# Altium schematic sheet MicroSD.SchDoc
size A4; SheetNumber: 1; SheetTotal: 3
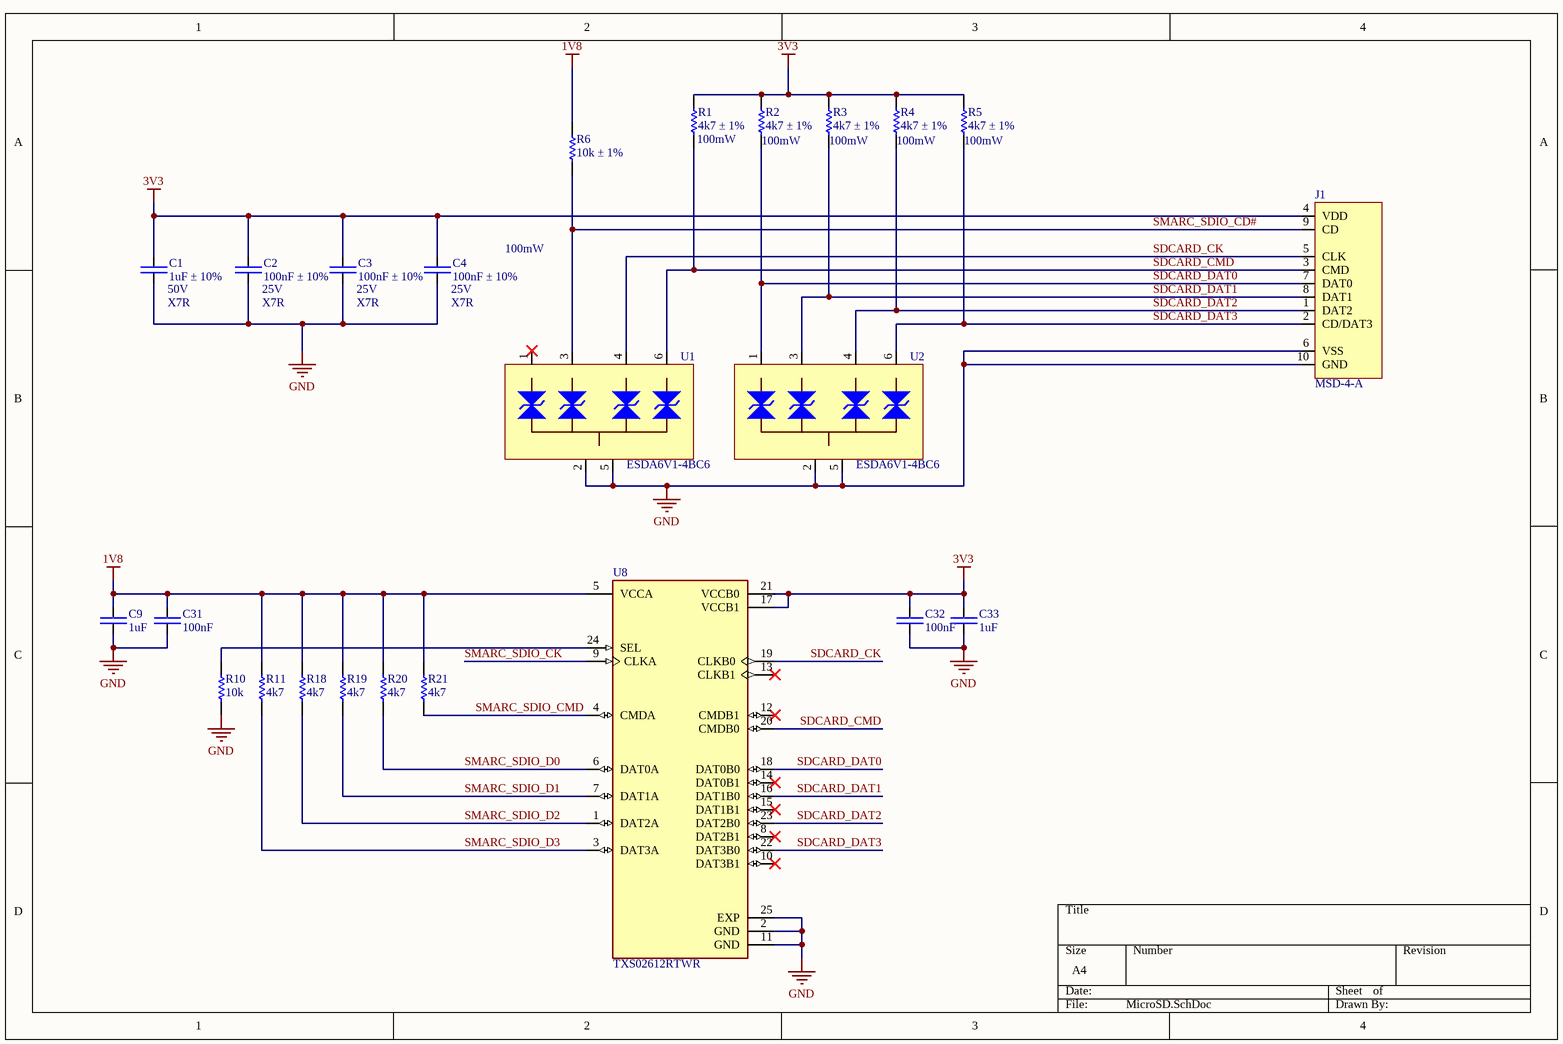
[diagram p0: MicroSD.SchDoc]

## Parts
C1  1uF ± 10%  [CAP-0805]
C2  100nF ± 10%  [CAP-0603]
C3  100nF ± 10%  [CAP-0603]
C4  100nF ± 10%  [CAP-0603]
C9  1uF  [CAP-0805]
C31  100nF  [CAP-0603]
C32  100nF  [CAP-0603]
C33  1uF  [CAP-0805]
J1  MSD-4-A  [MSD-4-A]
R1  4k7 ± 1%  [RES-0603]
R2  4k7 ± 1%  [RES-0603]
R3  4k7 ± 1%  [RES-0603]
R4  4k7 ± 1%  [RES-0603]
R5  4k7 ± 1%  [RES-0603]
R6  10k ± 1%  [RES-0603]
R10  10k  [RES-0603]
R11  4k7  [RES-0603]
R18  4k7  [RES-0603]
R19  4k7  [RES-0603]
R20  4k7  [RES-0603]
R21  4k7  [RES-0603]
U1  ESDA6V1-4BC6  [ESDA6V1-4BC6]
U2  ESDA6V1-4BC6  [ESDA6V1-4BC6]
U8  TXS02612RTWR  [TXS02612RTWR]

## Nets
1V8: C9.2 C31.2 R6.2 R11.2 R18.2 R19.2 R20.2 R21.2 U8.5(VCCA)
3V3: C1.2 C2.2 C3.2 C4.2 C32.2 C33.2 J1.4(VDD) R1.2 R2.2 R3.2 R4.2 R5.2 U8.17(VCCB1) U8.21(VCCB0)
GND: C1.1 C2.1 C3.1 C4.1 C9.1 C31.1 C32.1 C33.1 J1.6(VSS) J1.10(GND) R10.1 U1.2 U1.5 U2.2 U2.5 U8.2(GND) U8.11(GND) U8.25(EXP)
SDCARD_CK: J1.5(CLK) U1.4 U8.19(CLKB0)
SDCARD_CMD: J1.3(CMD) R1.1 U1.6 U8.20(CMDB0)
SDCARD_DAT0: J1.7(DAT0) R2.1 U2.1 U8.18(DAT0B0)
SDCARD_DAT1: J1.8(DAT1) R3.1 U2.3 U8.16(DAT1B0)
SDCARD_DAT2: J1.1(DAT2) R4.1 U2.4 U8.23(DAT2B0)
SDCARD_DAT3: J1.2(CD/DAT3) R5.1 U2.6 U8.22(DAT3B0)
SMARC_SDIO_CD#: J1.9(CD) R6.1 U1.3
SMARC_SDIO_CK: U8.9(CLKA)
SMARC_SDIO_CMD: R21.1 U8.4(CMDA)
SMARC_SDIO_D0: R20.1 U8.6(DAT0A)
SMARC_SDIO_D1: R19.1 U8.7(DAT1A)
SMARC_SDIO_D2: R18.1 U8.1(DAT2A)
SMARC_SDIO_D3: R11.1 U8.3(DAT3A)
NetR10_2: R10.2 U8.24(SEL)

Not connected (* = marked no-connect by the designer): U1 1*; U8 8(DAT2B1)* 10(DAT3B1)* 12(CMDB1)* 13(CLKB1)* 14(DAT0B1)* 15(DAT1B1)*

## Notes on the sheet
- (near R1) 100mW
- (near R2) 100mW
- (near R3) 100mW
- (near R4) 100mW
- (near R5) 100mW
- 100mW
- (near C1) 50V
- (near C1) X7R
- (near C2) 25V
- (near C2) X7R
- (near C3) 25V
- (near C3) X7R
- (near C4) 25V
- (near C4) X7R

## Library data of the parts
C1 C9 C33 = CAP-0805: Capacitor chip unpolarized. 0805
C2-C4 C31 C32 = CAP-0603: Capacitor chip unpolarized. 0603
J1 = MSD-4-A: Micro SD Connector
R1-R6 R10 R11 R18-R21 = RES-0603: Resistor chip. 0603
U1 U2 = ESDA6V1-4BC6: TVS Diode array 5VRM 7.4VC
U8 = TXS02612RTWR: Voltage Level Translator 24-Pin WQFN EP T/R; MF: Texas Instruments; MP: TXS02612RTWR .; SnapEDA_Link: https://www.snapeda.com/parts/TXS02612RTWR%20./Texas+Instruments/view-part/?ref=snap; Package: None; Value: *; Check_prices: https://www.snapeda.com/parts/TXS02612RTWR%20./Texas+Instruments/view-part/?ref=eda